# EasyEDA schematic schematic.json
TITLE: Cronus; REV: 1.1; Date: 2021-08-16; Sheet: 1/1; Drawn By: alexander.shepetko; Company: Alexander Shepetko
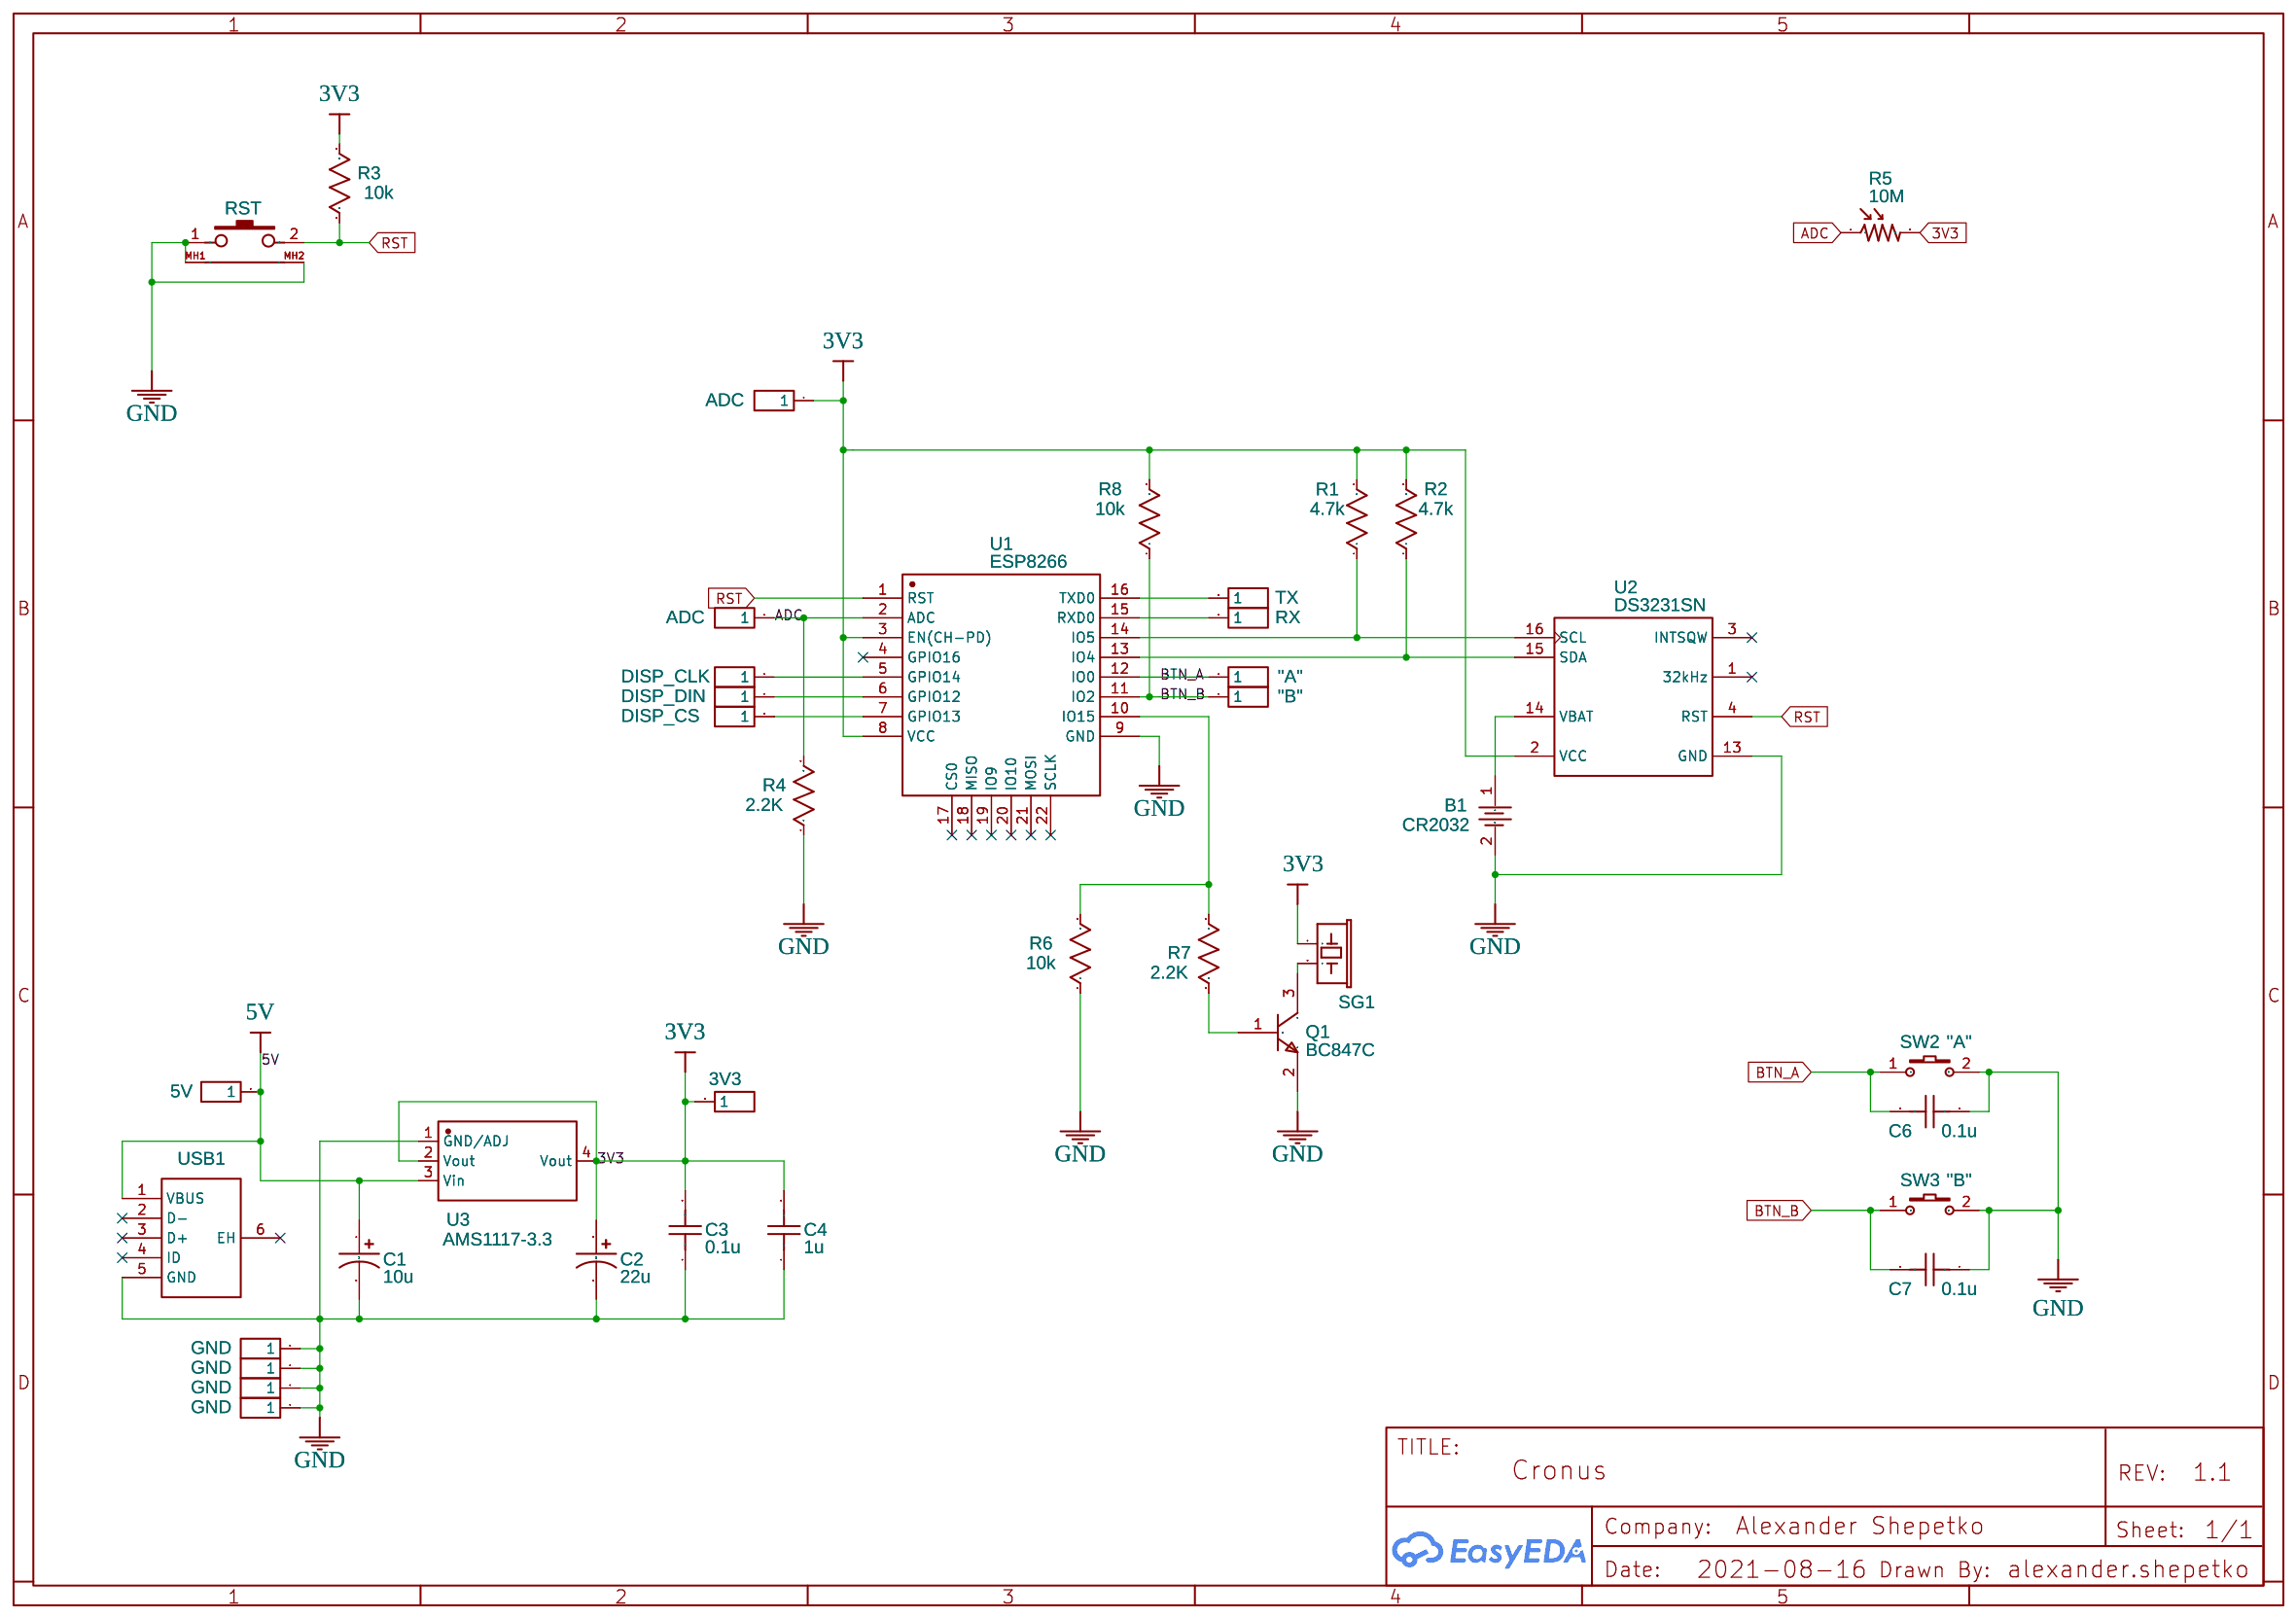
[diagram p0: schematic sheet]

## Parts
B1  CR2032  [BAT-TH_BS-2-1]
C1  10u  [C1206]
C2  22u  [C1206]
C3  0.1u  [C1206]
C4  1u  [C1206]
C6  0.1u  [C0805]
C7  0.1u  [C0805]
J1  DISP_CLK  [HDR-M-2.54_1X1]
J2  DISP_DIN  [HDR-M-2.54_1X1]
J3  DISP_CS  [HDR-M-2.54_1X1]
J4  "A"  [HDR-M-2.54_1X1]
J5  TX  [HDR-M-2.54_1X1]
J6  RX  [HDR-M-2.54_1X1]
J7  "B"  [HDR-M-2.54_1X1]
J8  ADC  [HDR-M-2.54_1X1]
J9  GND  [HDR-M-2.54_1X1]
J10  ADC  [HDR-M-2.54_1X1]
J11  GND  [HDR-M-2.54_1X1]
J12  5V  [HDR-M-2.54_1X1]
J13  GND  [HDR-M-2.54_1X1]
J14  GND  [HDR-M-2.54_1X1]
J15  3V3  [HDR-M-2.54_1X1]
Q1  BC847C  [SOT23-3]
R1  4.7k  [R1206]
R2  4.7k  [R1206]
R3  10k  [R1206]
R4  2.2K  [R1206]
R5  10M  [PDV-P9XXX]
R6  10k  [R1206]
R7  2.2K  [R1206]
R8  10k  [R1206]
SG1  BUZZER  [BUZZER_12X9.5RM7.6]
SW1  RST  [SW-TH_4PIN_L11.90-W7.70]
SW2  "A"  [KEY-SMD_2P-L6.2-W3.6-LS8.0]
SW3  "B"  [KEY-SMD_2P-L6.2-W3.6-LS8.0]
U1  ESP8266  [WIFIM-SMD_ESP-12F-ESP8266MOD]
U2  DS3231SN  [SOIC-16_L10.3-W7.5-P1.27-LS10.3-BL]
U3  AMS1117-3.3  [SOT-223-3_L6.5-W3.4-P2.30-LS7.0-BR]
USB1  A4A0505-C-30-R  [MICRO-USB-SMD_MICRO-USB-A17]

## Library data of the parts
B1 = CR2032-BS-2-1: Supplier: LCSC; Manufacturer: Q&J; Manufacturer Part: BS-2-1; image: //image.lceda.cn/szlcsc/C70376.jpg; Supplier Part: C70376
C1 = C_Tan_SMD_A_US: Contributor: LCEDA_Lib; Package Display: No
C2 = C_Tan_SMD_A_US: Contributor: LCEDA_Lib
C3 C4 C6 C7 = C_0603_US: Contributor: LCEDA_Lib
J1-J15 = HDR-M-2.54_1x1: Supplier Part: C81276; Supplier: LCSC; Contributor: LCEDA_Lib
Q1 = BC847CLT3: General Purpose Transistor, NPN Silicon, 3-Pin SOT-23, Tape and Reel
R1-R4 R6-R8 = R_0603_US: Contributor: LCEDA_Lib
R5 = PHOTORESPDV-P9
SG1 = BUZZER: Contributor: SparkFun
SW1 = Button-6x6x9-Right-Angle: Supplier Part: C71842; Supplier: LCSC; Manufacturer: BBJ; Manufacturer Part: Switch,6*6*9Plastic head,260G, 0.25mm,Side bracket
SW2 SW3 = K2-3.6×6.1_SMD: Supplier Part: C118141; Supplier: LCSC; Manufacturer Part: K2-1107ST-A4SW-06; Contributor: LCEDA_Lib; 制造商: 韩国韩荣
U1 = ESP-12F(ESP8266MOD): Supplier: LCSC; Manufacturer: Ai-Thinker; Supplier Part: C82891; Paste Type: recommend
U2 = DS3231SN#: tags: Clock; Supplier Part: C9866; Supplier: LCSC; Manufacturer: MAXIM; subpart_no: 2; image: http://image.lceda.cn/szlcsc/C9866.jpg
U3 = AMS1117-3.3: sourceId: dwIGgezVh; Supplier: LCSC; Manufacturer: AMS; LCSC Assembly: Yes; image: //image.lceda.cn/szlcsc/C6186.jpg; Supplier Part: C6186; SMT Type: Basic
USB1 = A4A0505-C-30-R: Supplier: LCSC; Supplier Part: C694908; Manufacturer: TECONN; Contributor: LCSC

## Nets
3V3: C2.2(1) C3.2 C4.2 J10.1 J15.1 R1.2 R2.2 R3.2 R5.2 R8.2 SG1.1 U1.3(EN(CH-PD)) U1.8(VCC) U2.2(VCC) U3.2(Vout) U3.4(Vout)
5V: C1.1 J12.1 U3.3(Vin) USB1.1(VBUS)
GND: B1.2 C1.2 C2.1(2) C3.1 C4.1 C6.1 C7.1 J9.1 J11.1 J13.1 J14.1 Q1.2(E) R4.1 R6.1 SW1.1 SW1.MH1 SW1.MH2 SW2.2 SW3.2 U1.9(GND) U2.13(GND) U3.1(GND/ADJ) USB1.5(GND)
ADC: J8.1 R4.2 R5.1 U1.2(ADC)
BTN_A: C6.2 J4.1 SW2.1 U1.12(IO0)
BTN_B: C7.2 J7.1 R8.1 SW3.1 U1.11(IO2)
RST: R3.1 SW1.2 U1.1(RST) U2.4(RST)
Net-(B1-1): B1.1 U2.14(VBAT)
Net-(J1-1): J1.1 U1.5(GPIO14)
Net-(J2-1): J2.1 U1.6(GPIO12)
Net-(J3-1): J3.1 U1.7(GPIO13)
Net-(J5-1): J5.1 U1.16(TXD0)
Net-(J6-1): J6.1 U1.15(RXD0)
Net-(Q1-1): Q1.1(B) R7.2
Net-(Q1-3): Q1.3(C) SG1.2(1)
Net-(R1-1): R1.1 U1.14(IO5) U2.16(SCL)
Net-(R2-1): R2.1 U1.13(IO4) U2.15(SDA)
Net-(R6-2): R6.2 R7.1 U1.10(IO15)

Not connected (* = marked no-connect by the designer): U1 4(GPIO16)* 17(CS0)* 18(MISO)* 19(IO9)* 20(IO10)* 21(MOSI)* 22(SCLK)*; U2 1(32kHz)* 3(INTSQW)*; USB1 2(D-)* 3(D+)* 4(ID)* 6(EH)*
